# Altium schematic sheet Sheet1 (1).SchDoc
size A4; SheetNumber: 1; SheetTotal: 1
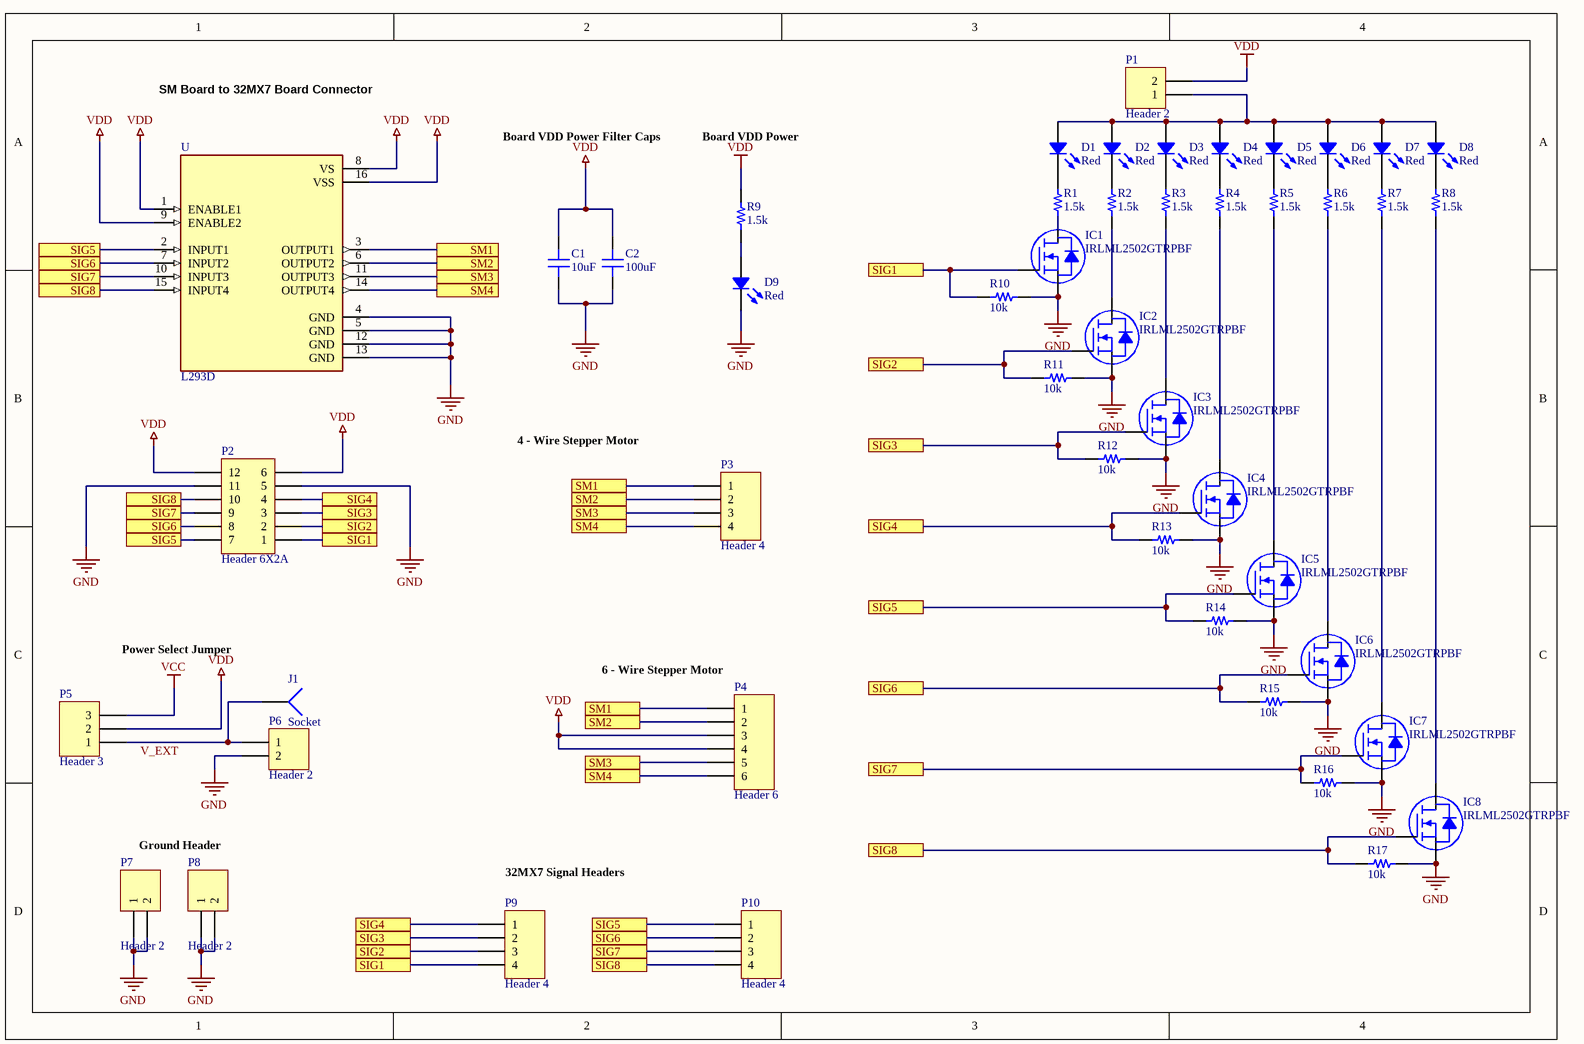
[diagram p0: Sheet1 (1).SchDoc]

## Parts
C1  10uF  [CAP 1206/3216]
C2  100uF  [CAP 1206/3216]
D1  Red  [LED 1206/3216 RED]
D2  Red  [LED 1206/3216 RED]
D3  Red  [LED 1206/3216 RED]
D4  Red  [LED 1206/3216 RED]
D5  Red  [LED 1206/3216 RED]
D6  Red  [LED 1206/3216 RED]
D7  Red  [LED 1206/3216 RED]
D8  Red  [LED 1206/3216 RED]
D9  Red  [LED 1206/3216 RED]
IC1  IRLML2502GTRPBF  [INFINEON SOT-23-3]
IC2  IRLML2502GTRPBF  [INFINEON SOT-23-3]
IC3  IRLML2502GTRPBF  [INFINEON SOT-23-3]
IC4  IRLML2502GTRPBF  [INFINEON SOT-23-3]
IC5  IRLML2502GTRPBF  [INFINEON SOT-23-3]
IC6  IRLML2502GTRPBF  [INFINEON SOT-23-3]
IC7  IRLML2502GTRPBF  [INFINEON SOT-23-3]
IC8  IRLML2502GTRPBF  [INFINEON SOT-23-3]
J1  Socket  [PIN1]
P1  Header 2  [HDR1X2]
P2  Header 6X2A  [HDR2X6_CEN]
P3  Header 4  [HDR1X4]
P4  Header 6  [HDR1X6]
P5  Header 3  [HDR1X3]
P6  Header 2  [HDR1X2]
P7  Header 2  [HDR1X2]
P8  Header 2  [HDR1X2]
P9  Header 4  [HDR1X4]
P10  Header 4  [HDR1X4]
R1  1.5k  [RES 1206/3216]
R2  1.5k  [RES 1206/3216]
R3  1.5k  [RES 1206/3216]
R4  1.5k  [RES 1206/3216]
R5  1.5k  [RES 1206/3216]
R6  1.5k  [RES 1206/3216]
R7  1.5k  [RES 1206/3216]
R8  1.5k  [RES 1206/3216]
R9  1.5k  [RES 1206/3216]
R10  10k  [RES 1206/3216]
R11  10k  [RES 1206/3216]
R12  10k  [RES 1206/3216]
R13  10k  [RES 1206/3216]
R14  10k  [RES 1206/3216]
R15  10k  [RES 1206/3216]
R16  10k  [RES 1206/3216]
R17  10k  [RES 1206/3216]
U  L293D  [DIP880W50P254L2000H510Q16]

## Ports
SIG1, SIG2, SIG3, SIG4, SIG5, SIG6, SIG7, SIG8, SM1, SM2, SM3, SM4

## Nets
GND: C1.1 C2.1 D9.2 IC1.3(S) IC2.3(S) IC3.3(S) IC4.3(S) IC5.3(S) IC6.3(S) IC7.3(S) IC8.3(S) P2.5 P2.11 P6.2 P7.1 P7.2 P8.1 P8.2 R10.2 R11.2 R12.2 R13.2 R14.2 R15.2 R16.2 R17.2 U.4(GND) U.5(GND) U.12(GND) U.13(GND)
VCC: P5.3
VDD: C1.2 C2.2 P1.2 P2.6 P2.12 P4.3 P4.4 P5.2 R9.2 U.1(ENABLE1) U.8(VS) U.9(ENABLE2) U.16(VSS)
SIG1: IC1.1(G) P2.1 P9.4 R10.1 ; port SIG1
SIG2: IC2.1(G) P2.2 P9.3 R11.1 ; port SIG2
SIG3: IC3.1(G) P2.3 P9.2 R12.1 ; port SIG3
SIG4: IC4.1(G) P2.4 P9.1 R13.1 ; port SIG4
SIG5: IC5.1(G) P2.7 P10.1 R14.1 U.2(INPUT1) ; port SIG5
SIG6: IC6.1(G) P2.8 P10.2 R15.1 U.7(INPUT2) ; port SIG6
SIG7: IC7.1(G) P2.9 P10.3 R16.1 U.10(INPUT3) ; port SIG7
SIG8: IC8.1(G) P2.10 P10.4 R17.1 U.15(INPUT4) ; port SIG8
SM1: P3.1 P4.1 U.3(OUTPUT1) ; port SM1
SM2: P3.2 P4.2 U.6(OUTPUT2) ; port SM2
SM3: P3.3 P4.5 U.11(OUTPUT3) ; port SM3
SM4: P3.4 P4.6 U.14(OUTPUT4) ; port SM4
V_EXT: J1.1 P5.1 P6.1
NetD1_1: D1.1 D2.1 D3.1 D4.1 D5.1 D6.1 D7.1 D8.1 P1.1
NetD1_2: D1.2 R1.2
NetD2_2: D2.2 R2.2
NetD3_2: D3.2 R3.2
NetD4_2: D4.2 R4.2
NetD5_2: D5.2 R5.2
NetD6_2: D6.2 R6.2
NetD7_2: D7.2 R7.2
NetD8_2: D8.2 R8.2
NetD9_1: D9.1 R9.1
NetIC1_2: IC1.2(D) R1.1
NetIC2_2: IC2.2(D) R2.1
NetIC3_2: IC3.2(D) R3.1
NetIC4_2: IC4.2(D) R4.1
NetIC5_2: IC5.2(D) R5.1
NetIC6_2: IC6.2(D) R6.1
NetIC7_2: IC7.2(D) R7.1
NetIC8_2: IC8.2(D) R8.1

## Notes on the sheet
- SM Board to 32MX7 Board Connector
- Board VDD Power Filter Caps
- Board VDD Power LED
- 4 - Wire Stepper Motor Header
- Power Select Jumper
- (near P4) 6 - Wire Stepper Motor Header
- Ground Header
- (near P9) 32MX7 Signal Headers

## Library data of the parts
C1 = CL31A106KOCLNNC: CAP CER 10UF 16V X5R 1206; Manufacturer: Samsung Electro-Mechanics America, Inc.; TemperatureRange: -55C ~ 85C; Tolerance: 10%; Value: 10uF; Part Number: CL31A106KOCLNNC; PartId: 15855; Supplier 1: Digi-Key; Supplier Part Number 1: 1276-2721-2-ND; ComponentLink1Description: Datasheet; ComponentLink1URL: //media.digikey.com/pdf/Data%20Sheets/Samsung%20PDFs/CL31A106KOCLNNC_Spec.pdf; ComponentLink2Description: Digi-Key Listing; ComponentLink2URL: https://www.digikey.com/product-detail/en/samsung-electro-mechanics-america-inc/CL31A106KOCLNNC/1276-2721-2-ND/3888379; TemperatureCoefficient: X5R; Voltage: 16V; Price: 0.0558; Device Package: 1206 (3216 Metric)
C2 = CL31A107MQHNNNE: CAP CER 100UF 6.3V X5R 1206; Manufacturer: Samsung Electro-Mechanics America, Inc.; TemperatureRange: -55C ~ 85C; Tolerance: 20%; Value: 100uF; Part Number: CL31A107MQHNNNE; PartId: 15816; Supplier 1: Digi-Key; Supplier Part Number 1: 1276-1782-2-ND; ComponentLink1Description: Datasheet; ComponentLink1URL: http://www.samsungsem.com/kr/support/product-search/mlcc/CL31A107MQHNNNE.jsp; ComponentLink2Description: Digi-Key Listing; ComponentLink2URL: https://www.digikey.com/product-detail/en/samsung-electro-mechanics-america-inc/CL31A107MQHNNNE/1276-1782-2-ND/3887440; TemperatureCoefficient: X5R; Voltage: 6.3V; Price: 0.272; Device Package: 1206 (3216 Metric)
D1-D9 = SM1206NHC-IL: LED RED CLEAR 1206 SMD; Manufacturer: Bivar Inc.; Value: Green; Type: Surface Mount; Millicandela: 1250mcd; Voltage Forward: 2.1V; Current (Test): 20mA; Viewing Angle: 30; Part Number: SM1206NHC-IL; PartId: 7105; Supplier 1: Digi-Key; Supplier Part Number 1: 492-1944-2-ND; ComponentLink1Description: Datasheet; ComponentLink1URL: http://www.bivar.com/Portals/0/Products/SM1206NHC-IL.pdf; ComponentLink2Description: Digi-Key Listing; ComponentLink2URL: http://www.digikey.ca/product-detail/en/SM1206NHC-IL/492-1944-2-ND/5030132; Price: 0.1915; Device Package: 1206 (3216 Metric); Colour: Red; Lens Transparency: Clear
IC1-IC8 = IRLML2502GTRPBF: MOSFET N-CH 20V 4.2A SOT-23-3; Manufacturer: Infineon Technologies; Rds On (Max) at Id, Vgs: 45 mOhm @ 4.2A, 4.5V; Vgs(th) (Max) at Id: 12V; Gate Charge (Qg): 12nC @ 5V; Input Capacitance (Ciss) at Vds: 740pF @ 15V; Current Continuous Drain: 4.2A (Ta); Part Number: IRLML2502GTRPBF; PartId: 29488; Supplier 1: Digi-Key; Supplier Part Number 1: IRLML2502GTRPBFCT-ND; ComponentLink1Description: Datasheet; ComponentLink1URL: http://www.irf.com/product-info/datasheets/data/irlml2502gpbf.pdf; ComponentLink2Description: Digi-Key Listing; ComponentLink2URL: https://www.digikey.com/product-detail/en/infineon-technologies/IRLML2502GTRPBF/IRLML2502GTRPBFCT-ND/2354246; Price: 0.6; Type: N-Channel; Device Package: TO-236-3, SC-59, SOT-23-3; Drain to Source Voltage (Vdss): 20V
P1 P6-P8 = Header 2: Header, 2-Pin; LatestRevisionDate: 17-Jul-2002; LatestRevisionNote: Re-released for DXP Platform.; Publisher: Altium Limited
P2 = Header 6X2A: Header, 6-Pin, Dual row; LatestRevisionDate: 17-Jul-2002; LatestRevisionNote: Re-released for DXP Platform.; Publisher: Altium Limited
P3 P9 P10 = Header 4: Header, 4-Pin; LatestRevisionDate: 17-Jul-2002; LatestRevisionNote: Re-released for DXP Platform.; Publisher: Altium Limited
P4 = Header 6: Header, 6-Pin; LatestRevisionDate: 17-Jul-2002; LatestRevisionNote: Re-released for DXP Platform.; Publisher: Altium Limited
P5 = Header 3: Header, 3-Pin; LatestRevisionDate: 17-Jul-2002; LatestRevisionNote: Re-released for DXP Platform.; Publisher: Altium Limited
R1-R9 = ERJ-8ENF1501V: RES SMD 1.5K OHM 1% 1/4W 1206; Manufacturer: Panasonic Electronic Components; TemperatureRange: -55C ~ 155C; TemperatureCoefficient: 100ppm/C; PowerRating: 0.25W, 1/4W; Value: 1.5k; Part Number: ERJ-8ENF1501V; PartId: 2988; Supplier 1: Digi-Key; Supplier Part Number 1: P1.50KFTR-ND; ComponentLink1Description: Datasheet; ComponentLink1URL: http://industrial.panasonic.com/www-cgi/jvcr13pz.cgi?E+PZ+3+AOA0002+ERJ8ENF1501V+7+WW; ComponentLink2Description: Digi-Key listing; ComponentLink2URL: http://digikey.com/product-detail/en/ERJ-8ENF1501V/P1.50KFTR-ND/88895; Tolerance: 1%; Price: 0.0093; Type: Thick Film; Device Package: 1206 (3216 Metric)
R10-R17 = ERJ-8ENF1002V: RES SMD 10K OHM 1% 1/4W 1206; Manufacturer: Panasonic Electronic Components; TemperatureRange: -55C ~ 155C; TemperatureCoefficient: 100ppm/C; PowerRating: 0.25W, 1/4W; Value: 10k; Part Number: ERJ-8ENF1002V; PartId: 2956; Supplier 1: Digi-Key; Supplier Part Number 1: P10.0KFTR-ND; ComponentLink1Description: Datasheet; ComponentLink1URL: http://industrial.panasonic.com/www-cgi/jvcr13pz.cgi?E+PZ+3+AOA0002+ERJ8ENF1002V+7+WW; ComponentLink2Description: Digi-Key listing; ComponentLink2URL: http://digikey.com/product-detail/en/ERJ-8ENF1002V/P10.0KFTR-ND/89059; Tolerance: 1%; Price: 0.0093; Type: Thick Film; Device Package: 1206 (3216 Metric)
U = L293D: Bipolar Motor Driver Parallel 16-PowerDIP; MF: STMicroelectronics; Availability: Unavailable; SnapEDA_Link: https://www.snapeda.com/parts/L293D/STMicroelectronics/view-part/83726/?ref=snap; MP: L293D; Price: None; Package: SOIC-20 STMicroelectronics; Value: *
J1 = Socket: LatestRevisionDate: 17-Jul-2002; LatestRevisionNote: Re-released for DXP Platform.; Publisher: Altium Limited